# EAGLE design GBprinter-D1-Shield-EXT (EAGLE 9.6.2)
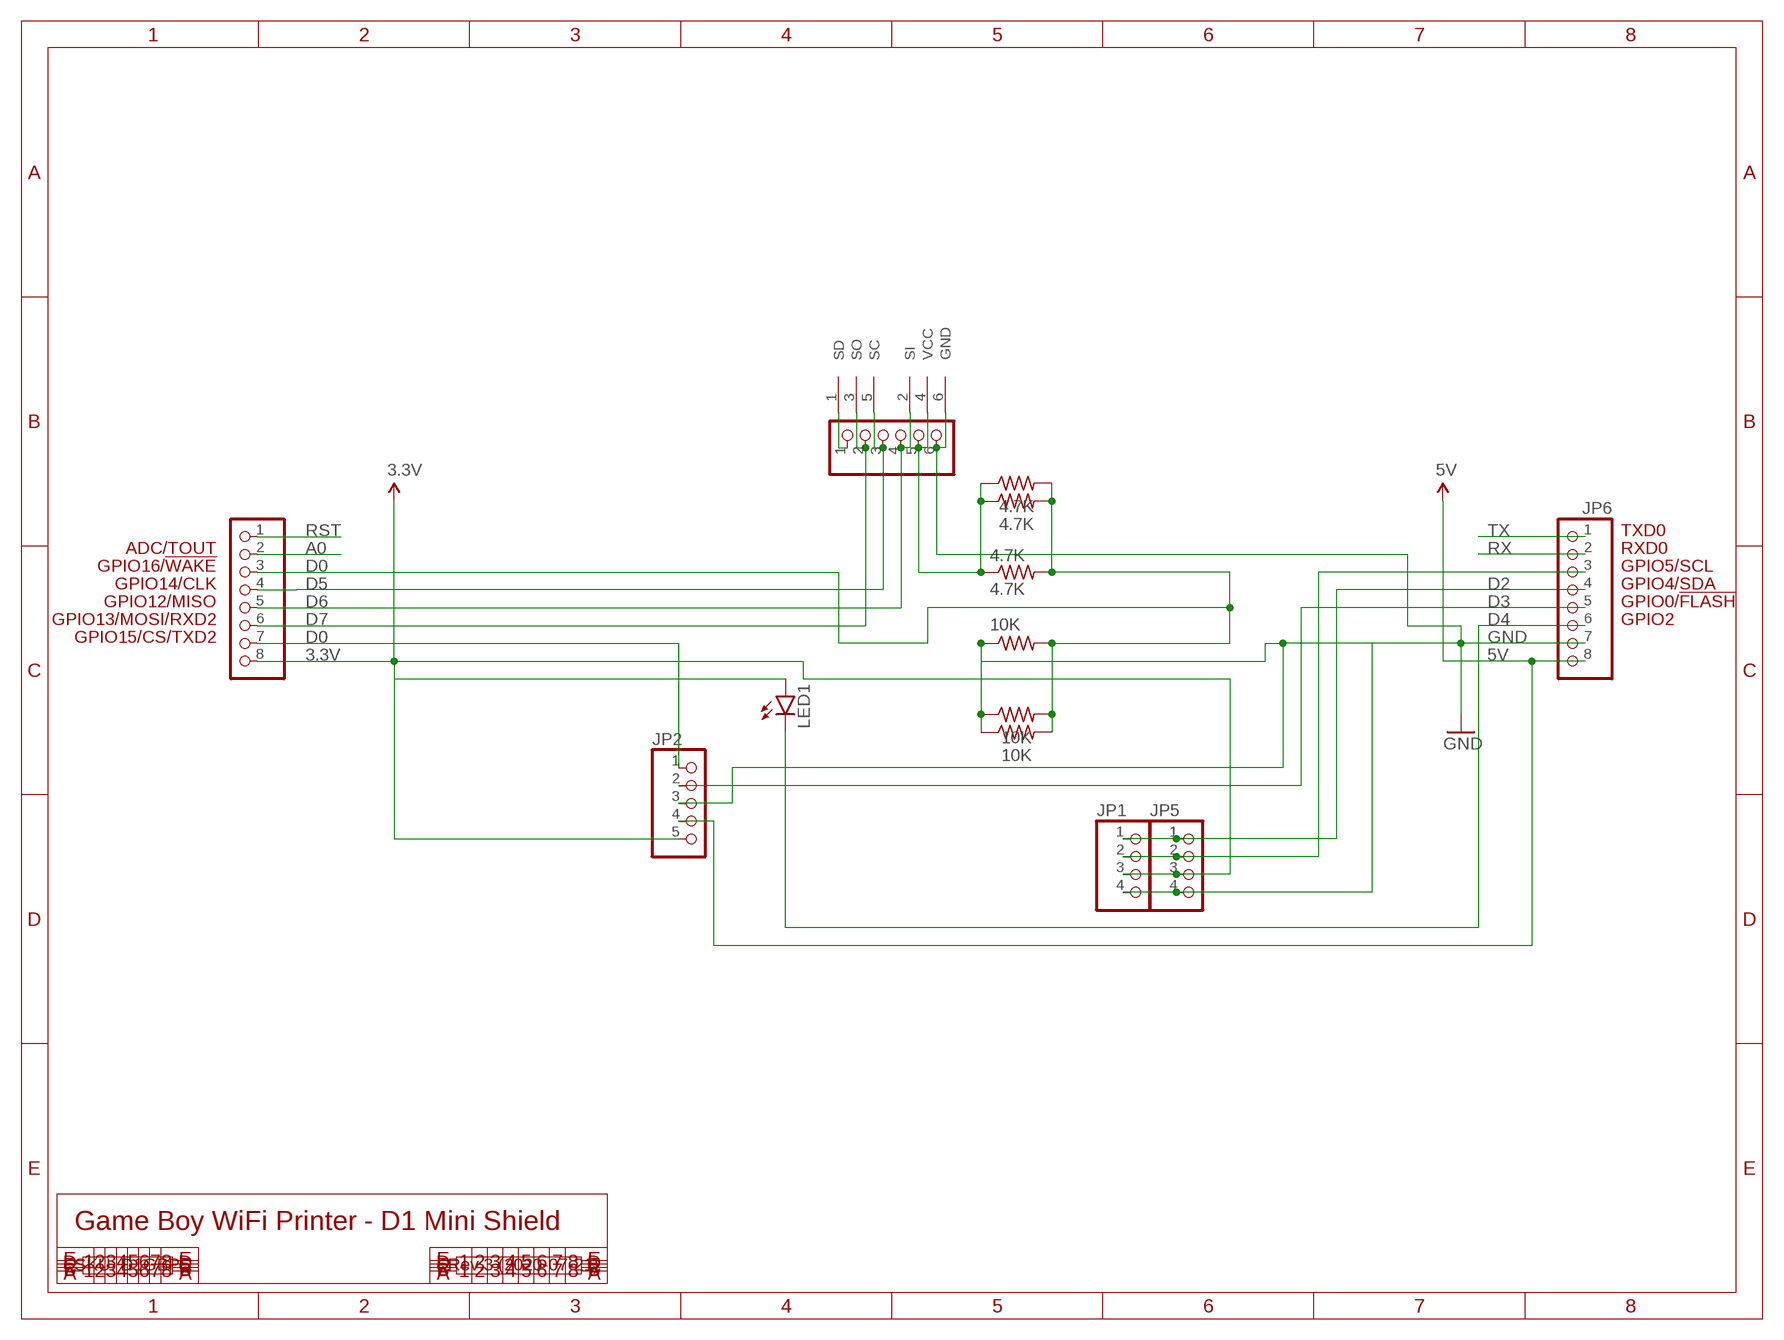
[diagram p0: schematic, sheet 1]

## Parts
4.7K  4.7K  R-US_0207/10  [0207/10]
10K  10K  R-US_0207/10  [0207/10]
JP1  PINHD-1X4/OCT  [1X04/OCT]
JP2  PINHD-1X5/OCT  [1X05/OCT]
JP3  PINHD-1X8/OCT  [1X08/OCT]
JP4  PINHD-1X6/OCT  [1X06/OCT]
JP5  PINHD-1X4/OCT  [1X04/OCT]
JP6  PINHD-1X8/OCT  [1X08/OCT]
LED1  LED3MM  [LED3MM]
R1  4.7K  R-US_CHIP-0805(2012-METRIC)  [RESC2012X65]
R2  10K  R-US_CHIP-0805(2012-METRIC)  [RESC2012X65]
R3  10K  R-US_CHIP-0805(2012-METRIC)  [RESC2012X65]
R5  4.7K  R-US_CHIP-0805(2012-METRIC)  [RESC2012X65]
U$2  GB-LINK-PADS  [GB-LINK-PCB]

## Nets
3.3V: JP1.3 JP2.5 JP3.8 JP5.3 LED1.A
5V: JP2.4 JP6.8
A0: JP3.2
D0: 4.7K.2 10K.2 JP3.3 R1.2 R2.2 R3.2 R5.2
D1: JP1.2 JP5.2 JP6.3
D2: JP1.1 JP5.1 JP6.4
D3: JP2.2 JP6.5
D4: JP6.6 LED1.K(C)
D5: JP3.4 JP4.3 U$2.5(SC)
D6: JP3.5 JP4.4 U$2.2(SI)
D7: JP3.6 JP4.2 U$2.3(SO)
D8: JP2.1 JP3.7
GND: 10K.1 JP1.4 JP2.3 JP4.6 JP5.4 JP6.7 R2.1 R3.1 U$2.6(GND)
RST: JP3.1
RX: JP6.2
SD: 4.7K.1 JP4.5 R1.1 R5.1 U$2.4(VCC)
TX: JP6.1
VCC: JP4.1 U$2.1(SD)

## Notes on the sheet
- TXD0
- ADC/TOUT | RXD0
- GPIO16/!WAKE | GPIO5/SCL
- GPIO14/CLK | GPIO4/SDA
- GPIO12/MISO | GPIO0/!FLASH
- GPIO13/MOSI/RXD2 | GPIO2
- GPIO15/CS/TXD2
- Game Boy WiFi Printer - D1 Mini Shield
- SKU: D1GBPS | Rev.3 (2020-07-21)

## Library data of the parts
4.7K 10K = resistor-noline:R-US_: RESISTOR, American symbol
JP1 JP5 = pinhead_v2:PINHD-1X4: PIN HEADER
JP2 = pinhead_v2:PINHD-1X5: PIN HEADER
JP3 JP6 = pinhead_v2:PINHD-1X8: PIN HEADER
JP4 = pinhead_v2:PINHD-1X6: PIN HEADER
LED1 = led:LED: LED OSRAM: - CHIPLED LG R971, LG N971, LY N971, LG Q971, LY Q971, LO R971, LY R971 LH N974, LH R974 LS Q976, LO Q976, LY Q976 LO Q996 - Hyper CHIPLED LW Q18S LB Q993, LB Q99A, LB R99A - SideLED LS A670, LO A670, LY A670, LG A670, LP A670 LB A673, LV A673, LT A673, LW A673 LH A674 LY A675 LS A676, LA A676, LO A676, LY A676, LW A676 LS A679, LY A679, LG A679 - Hyper Micro SIDELED® LS Y876, LA Y876, LO Y876, LY Y876 LT Y87S - SmartLED LW L88C, LW L88S LB L89C, LB L89S, LG L890 LS L89K, LO L89K, LY L89K LS L896, LA L896, LO L896, LY L896 - TOPLED LS T670, LO T670, LY T670, LG T670, LP T670 LSG T670, LSP T670, LSY T670, LOP T670, LYG T670 LG T671, LOG T671, LSG T671 LB T673, LV T673, LT T673, LW T673 LH T674 LS T676, LA T676, LO T676, LY T676, LB T676, LH T676, LSB T676, LW T676 LB T67C, LV T67C, LT T67C, LS T67K, LO T67K, LY T67K, LW E67C LS E67B, LA E67B, LO E67B, LY E67B, LB E67C, LV E67C, LT E67C LW T67C LS T679, LY T679, LG T679 LS T770, LO T770, LY T770, LG T770, LP T770 LB T773, LV T773, LT T773, LW T773 LH T774 LS E675, LA E675, LY E675, LS T675 LS T776, LA T776, LO T776, LY T776, LB T776 LHGB T686 LT T68C, LB T68C - Hyper Mini TOPLED® LB M676 - Mini TOPLED Santana® LG M470 LS M47K, LO M47K, LY M47K Source: http://www.osram.convergy.de LUXEON: - LUMILED® LXK2-PW12-R00, LXK2-PW12-S00, LXK2-PW14-U00, LXK2-PW14-V00 LXK2-PM12-R00, LXK2-PM12-S00, LXK2-PM14-U00 LXK2-PE12-Q00, LXK2-PE12-R00, LXK2-PE12-S00, LXK2-PE14-T00, LXK2-PE14-U00 LXK2-PB12-K00, LXK2-PB12-L00, LXK2-PB12-M00, LXK2-PB14-N00, LXK2-PB14-P00, LXK2-PB14-Q00 LXK2-PR12-L00, LXK2-PR12-M00, LXK2-PR14-Q00, LXK2-PR14-R00 LXK2-PD12-Q00, LXK2-PD12-R00, LXK2-PD12-S00 LXK2-PH12-R00, LXK2-PH12-S00 LXK2-PL12-P00, LXK2-PL12-Q00, LXK2-PL12-R00 Source: www.luxeon.com KINGBRIGHT: KA-3528ASYC Source: www.kingbright.com
R1-R3 R5 = Resistor:R-US: Resistor Fixed - ANSI; CATEGORY: Resistor; SUB-CATEGORY: Fixed
U$2 = link-port-pcb:GB-LINK-PADS

## Net classes
0 default: width 0.203 mm, drill 0.356 mm, clearance 0.152 mm
1 power: width 0.203 mm, clearance 0.152 mm

## Board
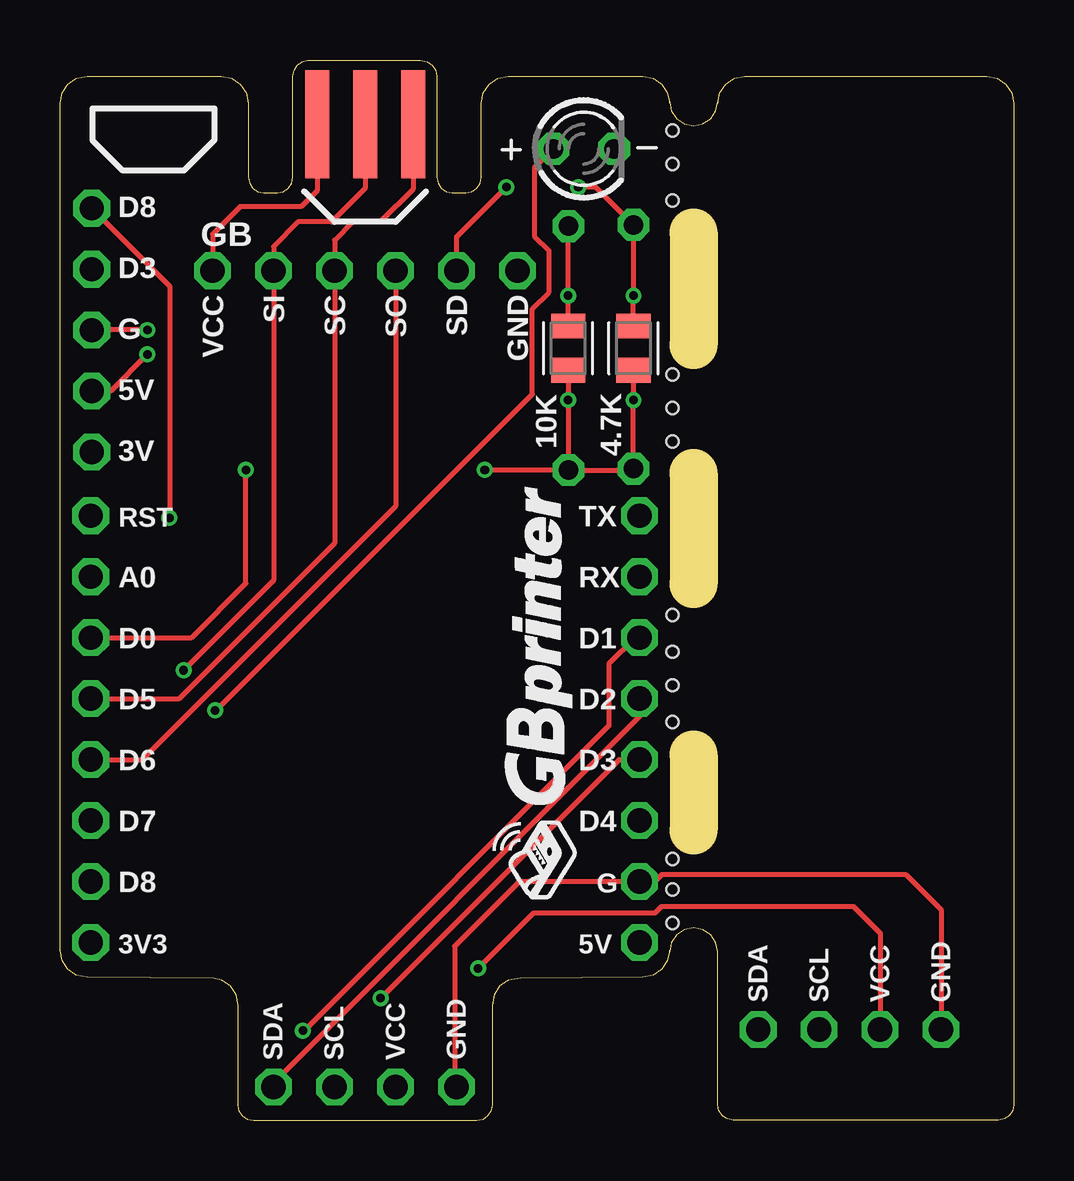
[diagram p1: board, top side]
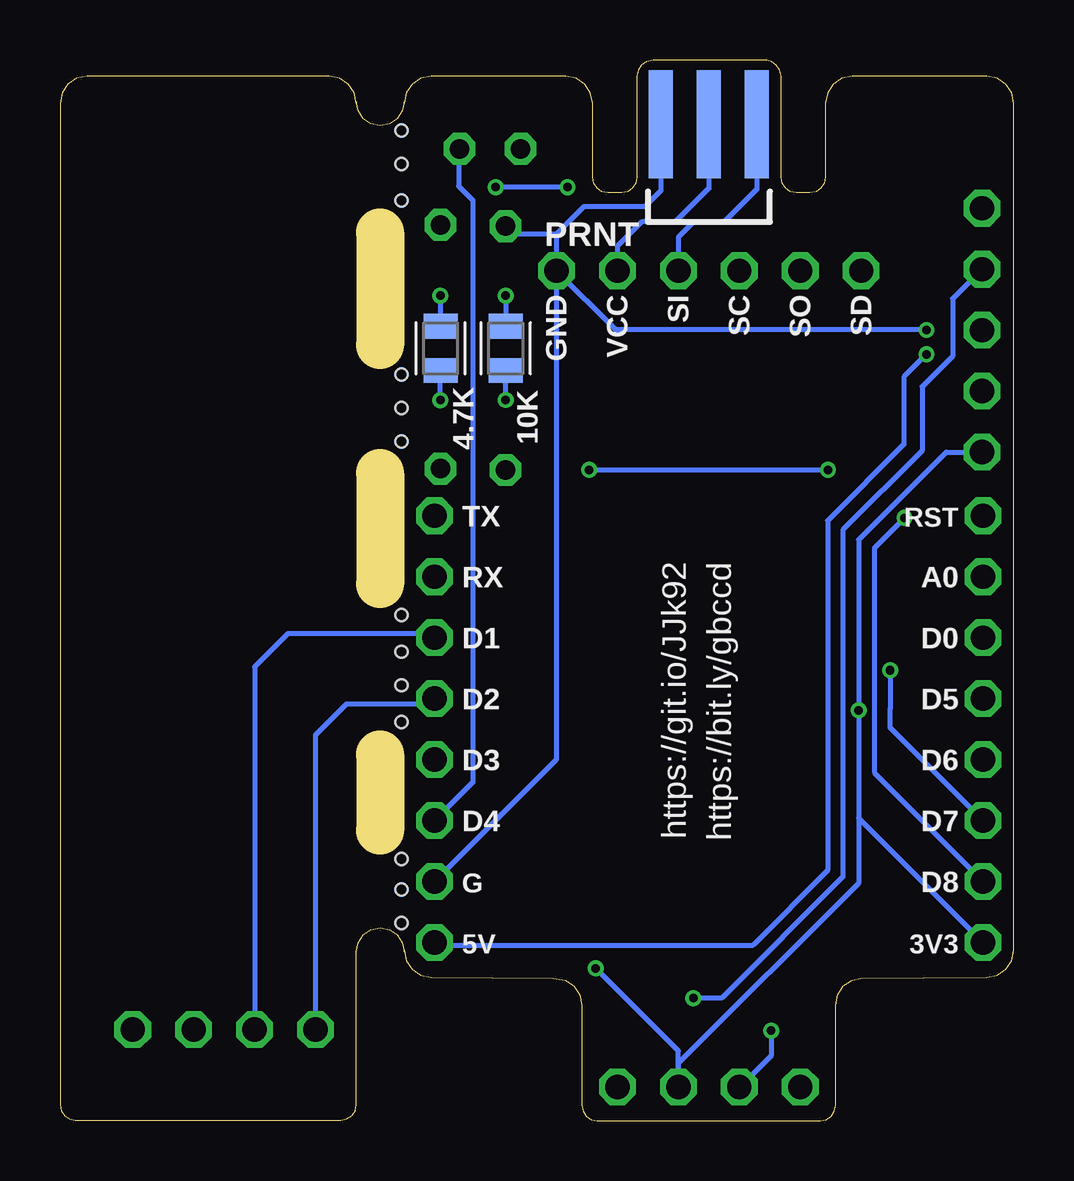
[diagram p2: board, bottom side, seen from below]

Size 39.74 x 44.2 mm. Coordinates in mm from the lower left corner, seen from the top.
Outline: 9.7,43.52 9.75,43.77 9.89,43.98 10.1,44.12 10.3,44.2 15.02,44.2 15.31,44.12 15.52,43.98 15.65,43.77 15.7,43.52 15.7,39.31 15.75,39.06 15.89,38.85 16.1,38.72 16.35,38.67 16.91,38.67 17.16,38.72 17.37,38.85 17.51,39.06 17.56,39.31 17.56,42.4 17.64,42.84 17.89,43.19 18.24,43.44 18.68,43.52 24.28,43.52 24.71,43.44 25.07,43.19 25.31,42.84 25.4,42.4 25.4,42.47 25.48,42.08 25.69,41.76 26.01,41.55 26.4,41.47 26.79,41.55 27.11,41.76 27.32,42.08 27.4,42.47 27.4,42.4 27.49,42.84 27.73,43.19 28.09,43.44 28.53,43.52 38.62,43.52 39.06,43.44 39.41,43.19 39.66,42.84 39.74,42.4 39.74,0.67 39.69,0.42 39.56,0.22 39.35,0.08 39.1,0.03 28.04,0.03 27.79,0.08 27.59,0.22 27.45,0.42 27.4,0.67 27.4,7.04 27.32,7.42 27.11,7.74 26.79,7.96 26.4,8.04 26.01,7.96 25.69,7.74 25.48,7.42 25.4,7.04 25.4,7.1 25.31,6.67 25.07,6.31 24.71,6.07 24.28,5.98 19.2,5.95 18.69,5.86 18.33,5.62 18.09,5.26 18,4.82 18,0.64 17.95,0.39 17.81,0.19 17.61,0.05 17.36,0 8.07,0 7.82,0.05 7.62,0.19 7.48,0.39 7.43,0.64 7.43,4.82 7.34,5.26 7.1,5.62 6.74,5.86 6.38,5.95 1.13,5.98 0.69,6.07 0.33,6.31 0.09,6.67 0,7.1 0,42.4 0.09,42.84 0.33,43.19 0.69,43.44 1.13,43.52 6.73,43.52 7.16,43.44 7.52,43.19 7.76,42.84 7.85,42.4 7.85,39.31 7.9,39.06 8.04,38.85 8.24,38.72 8.49,38.67 9.06,38.67 9.31,38.72 9.51,38.85 9.65,39.06 9.7,39.31 9.7,43.52
Copper layers (1*16): Top 0.035mm / dielectric 1.5mm / Bottom 0.035mm
Design rules "ElectroDragon_2layer_DRU_no_angle_20140221 *": minimum track width 6mil, minimum drill 12mil, track to track 6mil, track to pad 6mil, pad to pad 6mil, via to via 6mil, smd to smd 6mil, copper to edge 8mil, drill to drill 6mil, minimum pad ring 10mil, minimum via ring 6mil, stop-mask expansion 4mil, vias tented up to drill 100mil, thermal gap 0.3mm
Holes 0.5 mm at 25.52,9.64 25.52,10.91 25.52,8.24 25.52,18.15 25.52,21.07 25.52,16.62 25.52,29.7 25.52,31.1 25.52,28.31 25.52,39.86 25.52,41.26 25.52,38.34 25.52,19.54
Milling: 5 lines

### Footprints (pad centres in the part's own frame; a part is rotated, then mirrored left to right if it is on the bottom)
0207/10 = drill 0.813 octagon: 1 -5.08,0; 2 5.08,0
1X04/OCT = drill 1.016 octagon: 1 -3.81,0; 2 -1.27,0; 3 1.27,0; 4 3.81,0
1X05/OCT = drill 1.016 octagon: 1 -5.08,0; 2 -2.54,0; 3 0,0; 4 2.54,0; 5 5.08,0
1X08/OCT = drill 1.016 octagon: 1 -8.89,0; 2 -6.35,0; 3 -3.81,0; 4 -1.27,0; 5 1.27,0; 6 3.81,0; 7 6.35,0; 8 8.89,0
1X06/OCT = drill 1.016 octagon: 1 -6.35,0; 2 -3.81,0; 3 -1.27,0; 4 1.27,0; 5 3.81,0; 6 6.35,0
LED3MM = drill 0.813 octagon: A -1.27,0; K 1.27,0
RESC2012X65 = smd 1.031 x 1.42: 1 -0.919,0; 2 0.919,0
GB-LINK-PCB = smd 1 x 4.5: 1 -2,0; 3 0,0; 5 2,0 | smd 1 x 4.5 bottom: 2 -2,0; 4 0,0; 6 2,0

### Placement (x,y rotation side)
4.7K  23.89,32.25 270 bottom
10K  21.18,32.2 270 bottom
JP1  12.71,1.41 0 top
JP2  1.32,32.94 270 top
JP3  1.28,16.32 270 top
JP4  12.71,35.42 0 top
JP5  32.9,3.8 0 top
JP6  24.14,16.32 270 top
LED1  21.82,40.5 0 top
R1  23.89,32.2 270 top
R2  21.17,32.2 270 top
R3  21.17,32.18 270 bottom
R5  23.88,32.18 270 bottom
U$2  12.71,41.52 0 top

### Tracks (layer width: path | path; a pad name or v marks a point on that pad's centre or on a via)
3.3V  (via drill 0.36)
  Top 0.203: LED1.A 19.77,39.72 19.77,36.86 20.38,36.25 20.38,34.53 19.68,33.83 19.68,30.28 6.48,17.09 v6.47,17.1 | v17.42,6.35 19.73,8.66 24.8,8.66 25.07,8.94 33.06,8.94 34.17,7.82 JP5.3
  Bottom 0.203: JP2.5 2.82,27.86 6.47,24.21 v6.47,17.1 6.47,12.61 | 6.47,12.61 6.47,9.91 13.98,2.39 JP1.3 13.98,2.91 v17.42,6.35 | JP3.8 6.47,12.61
5V  (via drill 0.36)
  Top 0.203: v3.64,31.94 2.1,30.4 JP2.4
  Bottom 0.203: JP6.8 24.03,7.32 10.87,7.32 7.76,10.43 7.76,25.01 4.58,28.18 4.58,31 v3.64,31.94
D0  (via drill 0.36)
  Top 0.203: R2.2 | R2.2 v21.17,30.04 21.18,30.02 10K.2 | R1.2 v23.9,30.03 v23.89,30.02 4.7K.2 23.84,27.12 10K.2 | 10K.2 v17.71,27.12 v17.7,27.12 | v7.74,27.12 7.74,22.39 5.48,20.13 JP3.3
  Bottom 0.203: v23.89,30.02 23.89,31.35 R5.2 | v21.17,30.04 R3.2 | R3.2 | v17.7,27.12 v7.74,27.12
D1  (via drill 0.36)
  Top 0.203: JP6.3 23.96,20.13 22.87,19.04 22.87,16.45 10.17,3.76 v10.12,3.76
  Bottom 0.203: v10.12,3.76 10.12,2.71 11.41,1.42 JP1.2 | JP6.3 24.61,20.13 24.78,20.3 30.25,20.3 31.63,18.92 JP5.2
D2
  Top 0.203: JP6.4 24.14,16.83 8.9,1.59 JP1.1
  Bottom 0.203: JP6.4 24.52,17.59 24.75,17.36 27.81,17.36 29.11,16.06 29.11,3.81 JP5.1
D3  (via drill 0.36)
  Top 0.203: v13.36,5.11 23.3,15.05 JP6.5
  Bottom 0.203: v13.36,5.11 12.17,5.11 7.12,10.16 7.12,24.62 3.82,27.93 3.82,30.59 2.55,31.86 2.55,34.25 JP2.2
D4
  Bottom 0.203: LED1.K 23.13,40.46 23.13,38.94 22.54,38.35 22.54,14.11 JP6.6
D5
  Top 0.203: U$2.5 14.71,38.82 13.35,37.45 12.2,37.45 11.44,36.69 JP4.3 11.44,24.06 4.97,17.59 JP3.4
D6
  Top 0.203: JP4.4 13.98,25.6 3.43,15.05 JP3.5
  Bottom 0.203: U$2.2 10.71,38.82 12.08,37.45 13.35,37.45 13.98,36.82 JP4.4
D7  (via drill 0.36)
  Top 0.203: U$2.3 12.71,38.85 11.31,37.45 9.92,37.45 8.9,36.44 JP4.2 8.9,22.52 v5.15,18.77
  Bottom 0.203: v5.15,18.77 5.15,17.16 5.15,16.38 JP3.6
D8  (via drill 0.36)
  Top 0.203: JP2.1 4.56,34.78 4.56,25.13 v4.55,25.12
  Bottom 0.203: v4.55,25.12 5.81,23.86 5.81,14.5 JP3.7 | v4.55,25.12
GND  (via drill 0.36)
  Top 0.203: v3.64,32.95 1.33,32.95 JP2.3 | R2.1 v21.17,34.38 10K.1 | JP1.4 16.45,1.49 16.45,7.27 19.14,9.97 JP6.7 24.79,9.97 25.09,10.27 35.24,10.27 36.71,8.8 JP5.4
  Bottom 0.203: U$2.6 14.71,38.75 15.38,38.09 17.92,38.09 19.06,36.94 | 19.06,36.94 JP4.6 | JP4.6 19.06,15.05 JP6.7 | v21.17,34.38 | v21.17,34.38 R3.1 | 19.06,36.94 20.85,36.94 10K.1 | v3.64,32.95 16.59,32.95 JP4.6
SD  (via drill 0.36)
  Top 0.203: R1.1 v23.9,34.38 v23.89,34.38 4.7K.1 | v18.6,38.9 16.52,36.82 JP4.5 | 4.7K.1 | 4.7K.1 22.32,38.9 v21.59,38.9
  Bottom 0.203: U$2.4 12.71,38.85 14.11,37.45 15.5,37.45 16.52,36.44 JP4.5 16.51,35.41 | v23.9,34.38 23.9,33.21 R5.1 | v18.6,38.9 v21.59,38.9
VCC
  Top 0.203: U$2.1 10.71,38.75 10.04,38.09 8.9,38.09 8.77,38.09 7.5,38.09 6.36,36.94 JP4.1

### Text on the board
tPlace: D8 | GB | D3 | VCC | SI | SC | SO | SD | GND | G | 5V | 3V | RST | TX | A0 | RX | D0 | D1 | D5 | D2 | D6 | D3 | D7 | D4 | D8 | G | 3V3 | 5V | SDA | SCL | VCC | GND | SDA | SCL | VCC | GND
bPlace: PRNT | SD | SO | SC | SI | VCC | GND | 10K | 4.7K | RST | TX | A0 | RX | D0 | D1 | D5 | https://bit.ly/gbccd | https://git.io/JJk92 | D2 | D6 | D3 | D7 | D4 | D8 | G | 3V3 | 5V